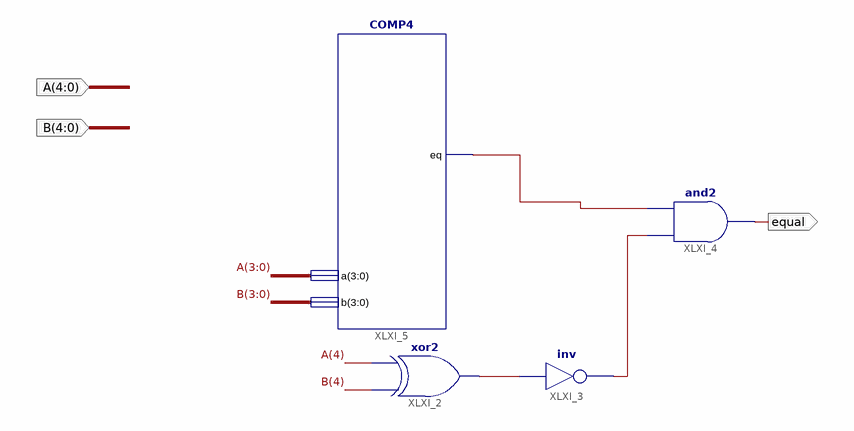
[diagram p0: schematic sheet 1]
// Xilinx ISE schematic COMP5.sch (artix7) as structural Verilog: 4 symbols, 3 ports
module COMP5 (
  input  [4:0] A,
  input  [4:0] B,
  output equal
);

  wire XLXN_13, XLXN_14, XLXN_15;

  xor XLXI_2 (XLXN_13, B[4], A[4]);
  not XLXI_3 (XLXN_14, XLXN_13);
  and XLXI_4 (equal, XLXN_14, XLXN_15);
  COMP4 XLXI_5 (.a(A[3:0]), .b(B[3:0]), .eq(XLXN_15));
endmodule
